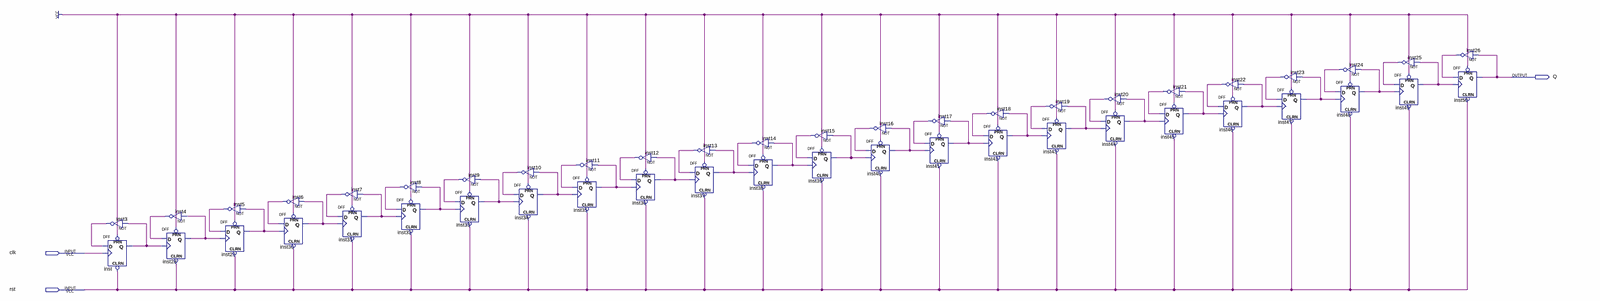
[diagram p0: schematic sheet, whole]
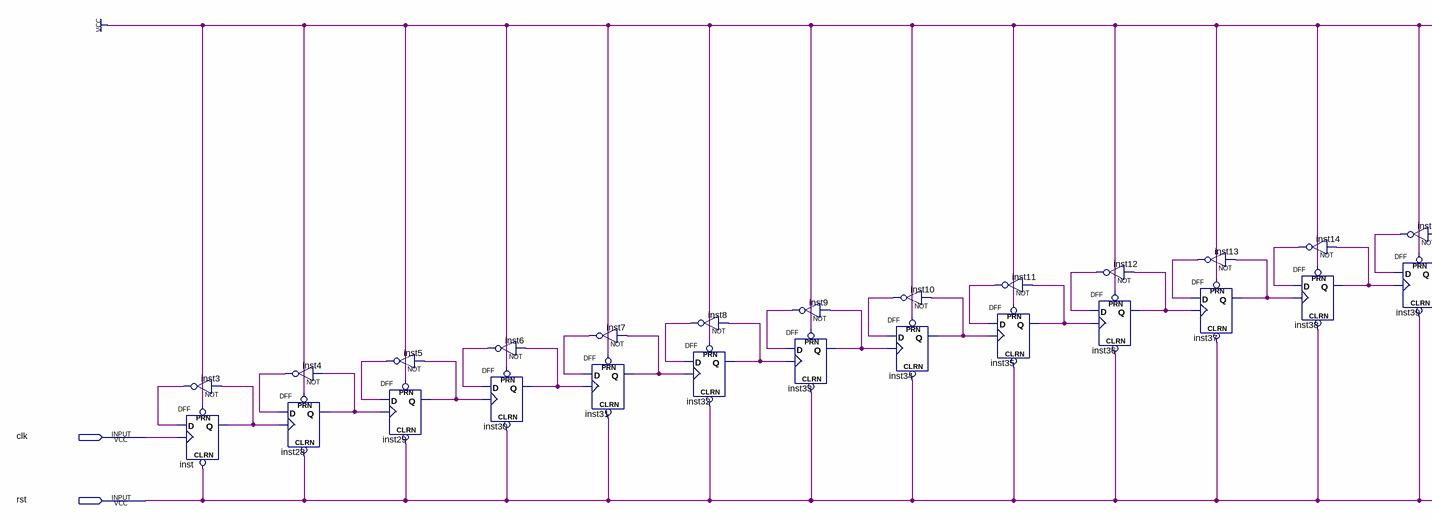
[diagram p1: schematic sheet, left part]
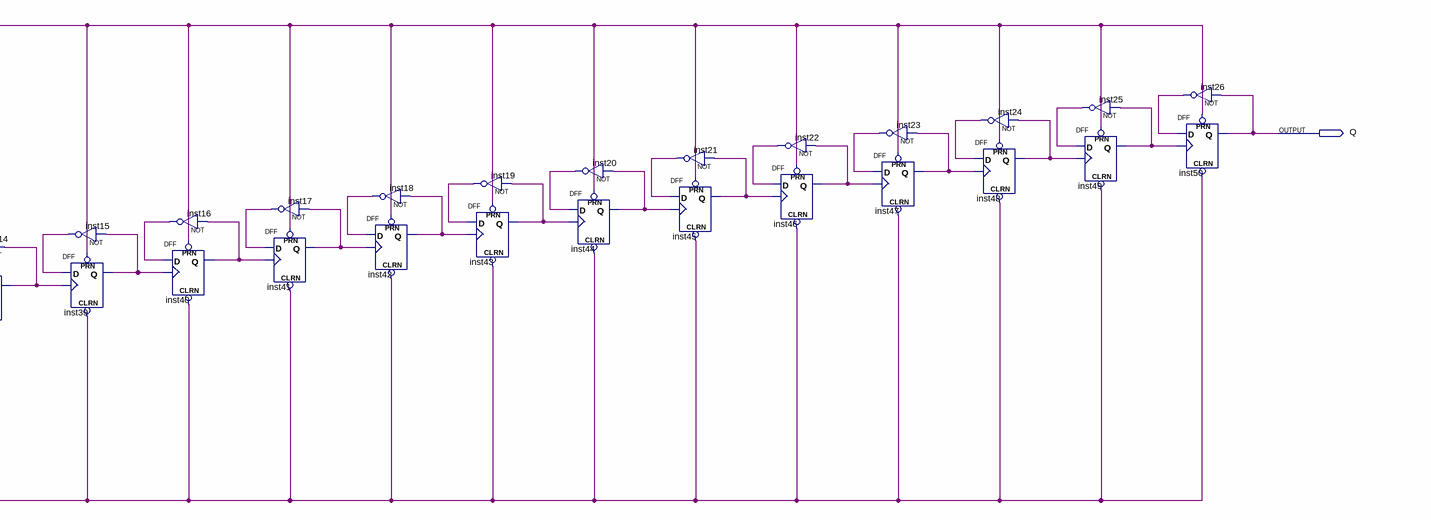
[diagram p2: schematic sheet, right part]
// Quartus schematic clock.bdf as structural Verilog: 48 symbols, 3 pins
module clock (
  input  clk,
  input  rst,
  output Q
);

  wire inst3_out, inst4_out, inst5_out, inst6_out, inst7_out, inst8_out, inst9_out, inst10_out, inst11_out,
       inst12_out, inst13_out, inst14_out, inst15_out, inst16_out, inst17_out, inst18_out, inst19_out,
       inst20_out, inst21_out, inst22_out, inst23_out, inst24_out, inst25_out, inst26_out, inst28_q,
       inst29_q, inst30_q, inst31_q, inst32_q, inst33_q, inst34_q, inst35_q, inst36_q, inst37_q, inst38_q,
       inst39_q, inst40_q, inst41_q, inst42_q, inst43_q, inst44_q, inst45_q, inst46_q, inst47_q, inst48_q,
       inst49_q, inst_q;

  not inst3 (inst3_out, inst_q);
  DFF inst (.CLRN(rst), .CLK(clk), .D(inst3_out), .PRN(1'b1), .Q(inst_q));
  not inst4 (inst4_out, inst28_q);
  DFF inst28 (.CLRN(rst), .CLK(inst_q), .D(inst4_out), .PRN(1'b1), .Q(inst28_q));
  not inst5 (inst5_out, inst29_q);
  DFF inst29 (.CLRN(rst), .CLK(inst28_q), .D(inst5_out), .PRN(1'b1), .Q(inst29_q));
  not inst6 (inst6_out, inst30_q);
  DFF inst30 (.CLRN(rst), .CLK(inst29_q), .D(inst6_out), .PRN(1'b1), .Q(inst30_q));
  not inst7 (inst7_out, inst31_q);
  DFF inst31 (.CLRN(rst), .CLK(inst30_q), .D(inst7_out), .PRN(1'b1), .Q(inst31_q));
  not inst8 (inst8_out, inst32_q);
  DFF inst32 (.CLRN(rst), .CLK(inst31_q), .D(inst8_out), .PRN(1'b1), .Q(inst32_q));
  not inst9 (inst9_out, inst33_q);
  DFF inst33 (.CLRN(rst), .CLK(inst32_q), .D(inst9_out), .PRN(1'b1), .Q(inst33_q));
  not inst10 (inst10_out, inst34_q);
  DFF inst34 (.CLRN(rst), .CLK(inst33_q), .D(inst10_out), .PRN(1'b1), .Q(inst34_q));
  not inst11 (inst11_out, inst35_q);
  DFF inst35 (.CLRN(rst), .CLK(inst34_q), .D(inst11_out), .PRN(1'b1), .Q(inst35_q));
  not inst12 (inst12_out, inst36_q);
  DFF inst36 (.CLRN(rst), .CLK(inst35_q), .D(inst12_out), .PRN(1'b1), .Q(inst36_q));
  not inst13 (inst13_out, inst37_q);
  DFF inst37 (.CLRN(rst), .CLK(inst36_q), .D(inst13_out), .PRN(1'b1), .Q(inst37_q));
  not inst14 (inst14_out, inst38_q);
  DFF inst38 (.CLRN(rst), .CLK(inst37_q), .D(inst14_out), .PRN(1'b1), .Q(inst38_q));
  not inst15 (inst15_out, inst39_q);
  DFF inst39 (.CLRN(rst), .CLK(inst38_q), .D(inst15_out), .PRN(1'b1), .Q(inst39_q));
  not inst16 (inst16_out, inst40_q);
  DFF inst40 (.CLRN(rst), .CLK(inst39_q), .D(inst16_out), .PRN(1'b1), .Q(inst40_q));
  not inst17 (inst17_out, inst41_q);
  DFF inst41 (.CLRN(rst), .CLK(inst40_q), .D(inst17_out), .PRN(1'b1), .Q(inst41_q));
  not inst18 (inst18_out, inst42_q);
  DFF inst42 (.CLRN(rst), .CLK(inst41_q), .D(inst18_out), .PRN(1'b1), .Q(inst42_q));
  not inst19 (inst19_out, inst43_q);
  DFF inst43 (.CLRN(rst), .CLK(inst42_q), .D(inst19_out), .PRN(1'b1), .Q(inst43_q));
  not inst20 (inst20_out, inst44_q);
  DFF inst44 (.CLRN(rst), .CLK(inst43_q), .D(inst20_out), .PRN(1'b1), .Q(inst44_q));
  not inst21 (inst21_out, inst45_q);
  DFF inst45 (.CLRN(rst), .CLK(inst44_q), .D(inst21_out), .PRN(1'b1), .Q(inst45_q));
  not inst22 (inst22_out, inst46_q);
  DFF inst46 (.CLRN(rst), .CLK(inst45_q), .D(inst22_out), .PRN(1'b1), .Q(inst46_q));
  not inst23 (inst23_out, inst47_q);
  DFF inst47 (.CLRN(rst), .CLK(inst46_q), .D(inst23_out), .PRN(1'b1), .Q(inst47_q));
  not inst24 (inst24_out, inst48_q);
  DFF inst48 (.CLRN(rst), .CLK(inst47_q), .D(inst24_out), .PRN(1'b1), .Q(inst48_q));
  not inst25 (inst25_out, inst49_q);
  DFF inst49 (.CLRN(rst), .CLK(inst48_q), .D(inst25_out), .PRN(1'b1), .Q(inst49_q));
  not inst26 (inst26_out, Q);
  DFF inst50 (.CLRN(rst), .CLK(inst49_q), .D(inst26_out), .PRN(1'b1), .Q(Q));
endmodule
